# Altium schematic sheet PowerSupply.SchDoc: Smart Bus Ticketing Machine/Power Supply
size A4; Date: 3/10/2025; ApprovedBy: Kiran Gunathilaka; CheckedBy: Kiran Gunathilaka; Author: Kiran Gunathilaka; DrawnBy: Kiran Gunathilaka; DocumentNumber: 07; Revision: v1.2; SheetNumber: 7; SheetTotal: 11
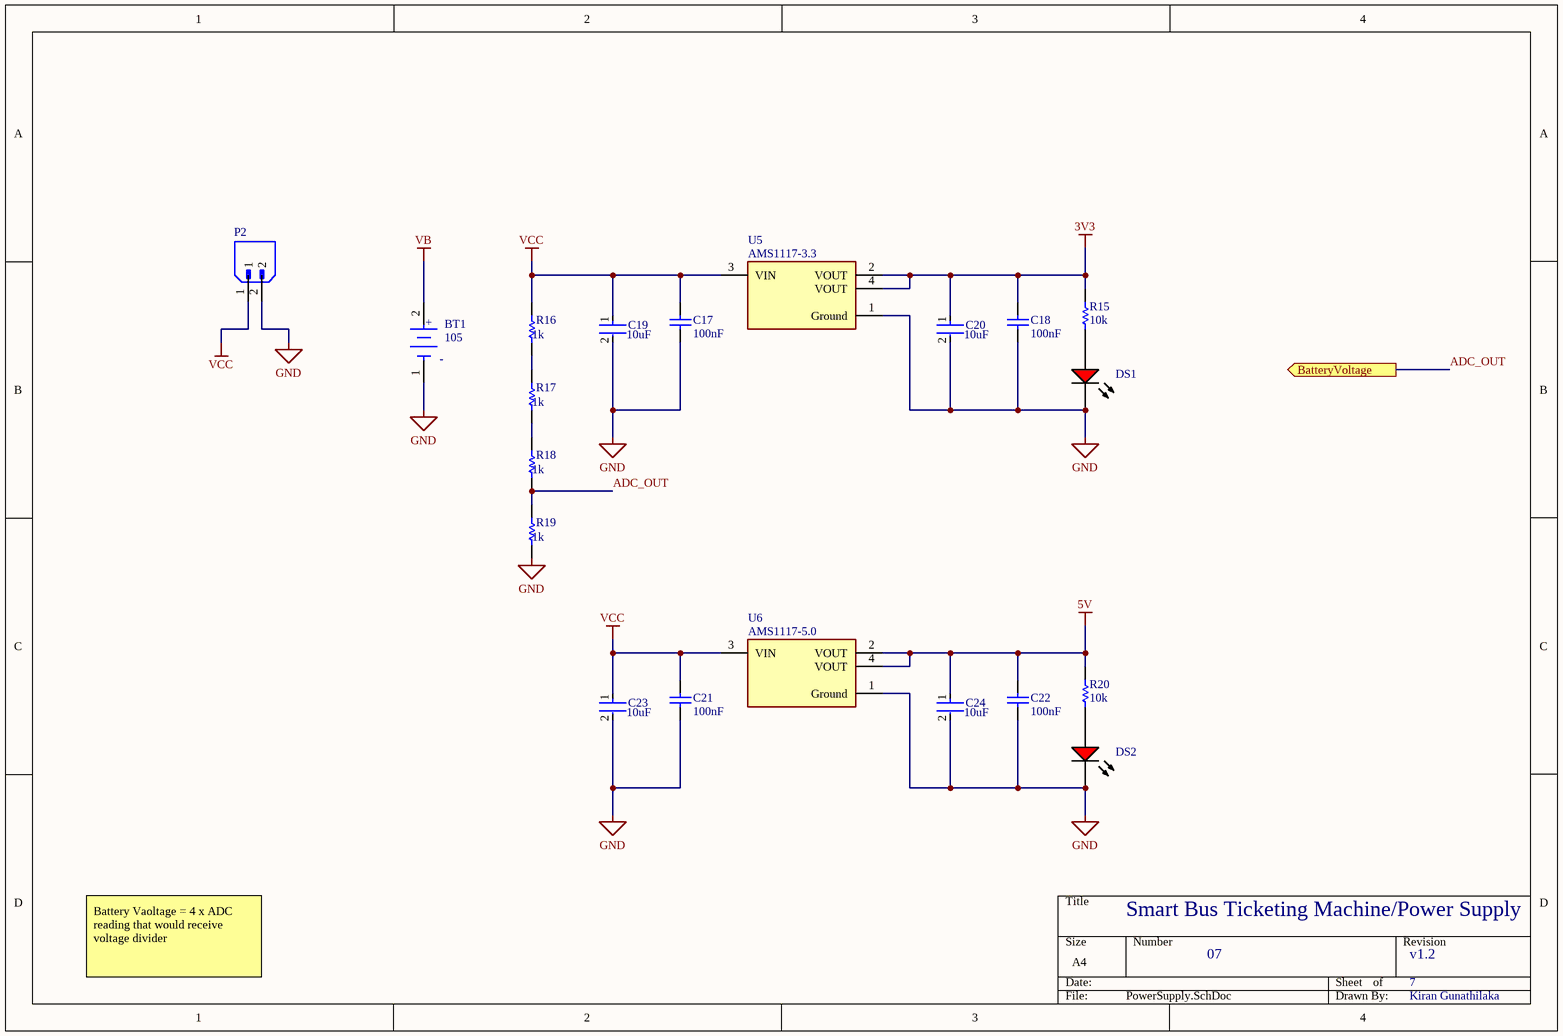
[diagram p0: PowerSupply.SchDoc]

## Parts
BT1  105  [FP-105-MFG]
C17  value 100nF  [CAPC2013X94X50ML20T25]  (hidden comment: 08051C152KAT2A)
C18  value 100nF  [CAPC2013X94X50ML20T25]  (hidden comment: 08051C152KAT2A)
C19  Capacitance: 10uF  [FP-C0805C106K9PACTU-MFG]  (hidden comment: C0805C106K9PACTU)
C20  Capacitance: 10uF  [FP-C0805C106K9PACTU-MFG]  (hidden comment: C0805C106K9PACTU)
C21  value 100nF  [CAPC2013X94X50ML20T25]  (hidden comment: 08051C152KAT2A)
C22  value 100nF  [CAPC2013X94X50ML20T25]  (hidden comment: 08051C152KAT2A)
C23  Capacitance: 10uF  [FP-C0805C106K9PACTU-MFG]  (hidden comment: C0805C106K9PACTU)
C24  Capacitance: 10uF  [FP-C0805C106K9PACTU-MFG]  (hidden comment: C0805C106K9PACTU)
DS1  HSMH-C150  [AVAG-HSMX-C150_V]  (value not drawn)
DS2  HSMH-C150  [AVAG-HSMX-C150_V]  (value not drawn)
P2  Battery Connector  [JST_B2B-XH-A(LF)(SN)]  (value not drawn)
R15  value 10k  [RESC2013X60X35NL10T20]  (hidden comment: RC0805FR-0710KL)
R16  Resistance: 1k  [RESC2013X60X35ML10T20]  (hidden comment: RC0805FR-071KL)
R17  Resistance: 1k  [RESC2013X60X35ML10T20]  (hidden comment: RC0805FR-071KL)
R18  Resistance: 1k  [RESC2013X60X35ML10T20]  (hidden comment: RC0805FR-071KL)
R19  Resistance: 1k  [RESC2013X60X35ML10T20]  (hidden comment: RC0805FR-071KL)
R20  value 10k  [RESC2013X60X35NL10T20]  (hidden comment: RC0805FR-0710KL)
U5  AMS1117-3.3  [FP-AMS1117-IPC_C]
U6  AMS1117-5.0  [FP-AMS1117-IPC_C]

## Ports
BatteryVoltage (out, see Main[1A])

## Nets
3V3: C18.2 C20.1 R15.1 U5.2(VOUT) U5.4(VOUT)
5V: C22.2 C24.1 R20.1 U6.2(VOUT) U6.4(VOUT)
GND: BT1.1(-) C17.1 C18.1 C19.2 C20.2 C21.1 C22.1 C23.2 C24.2 DS1.2(K) DS2.2(K) P2.2 R19.1 U5.1(Ground) U6.1(Ground)
VB: BT1.2(+)
VCC: C17.2 C19.1 C21.2 C23.1 P2.1 R16.2 U5.3(VIN) U6.3(VIN)
ADC_OUT: R18.1 R19.2 ; port BatteryVoltage
NetDS1_1: DS1.1(A) R15.2
NetDS2_1: DS2.1(A) R20.2
NetR16_1: R16.1 R17.2
NetR17_1: R17.1 R18.2

## Notes on the sheet
- Battery Vaoltage = 4 x ADC reading that would receive voltage divider

## Library data of the parts
BT1 = CMP-00214-00028800-1: 105 Battery Holder Coin Cell 1 Cell PC Pin PCB Through Hole Mount PBT 0.944 in. Dia; NexarPartId: 28800; Number of Contacts: 2; Number of Batteries: 1; Approvals: UL; Wire/Cable Gauge: 1AWG; Body Material: Glass, Nylon, PBT; Material: Plastic, Steel; REACH SVHC: No SVHC; Min Operating Temperature: -50°C; Lead Free: Lead Free; Height: 8.75mm; Diameter: 24mm; Termination: PC Pin; Max Operating Temperature: 145°C; Contact Material: Nickel; Number of Cells: 1; Packaging: Bulk; Contact Plating: Nickel; Mount: PCB, Through Hole; RoHS: Compliant
C17 C18 C21 C22 = CMP-2007-04179-1: Manufacturer: AVX Interconnect / Elco; Part Number: 08051C152KAT2A
C19 C20 C23 C24 = CMP-03020-034676-1: CAP CER 10UF 6.3V X5R 0805; Dielectric Material: Ceramic; Dissipation Factor: 5%; Tolerance: 10%; Thickness: 0.055inch; Mount: Surface Mount; Voltage: 6.3V; Case Code (Imperial): 0805; Lead Pitch: 0.75mm; Height: 1.25mm; Construction: Flat; Number of Pins: 2; Contact Material: Tin; Case/Package: 0805; Case Code (Metric): 2012; Termination: SMD/SMT; Width: 1.2mm; Dielectric: X5R; Lead Free: Lead Free; Min Operating Temperature: -55°C; Voltage Rating (DC): 6.3V; Series: C; Packaging: Tape and Reel; Radiation Hardening: No; Length: 2mm; REACH SVHC: No SVHC; RoHS Compliant: Yes; Max Operating Temperature: 85°C; Package Quantity: 1; Voltage Rating: 6.3V; Depth: 1.25mm
DS1 DS2 = CMP-2000-06426-1: LED Uni-Color Red, 65 mW, 25 mA, -40 to 85 degC, 2-Pin SMD, RoHS, Tape and Reel; Manufacturer: Avago; Product Height (mm): 1.1mm; Power Dissipation: 78W; Product Length (mm): 3.2mm; Forward Voltage: 2.6V; Luminous Intensity: 17mcd; DELETED: Compliant; Shape Type: Rectangular; Peak Wavelength: 660nm; Main Category: ChipLED; Dominant Wave Length: 639nm; Rad Hardened: No; Lens Type: ColorlessDiffused; Product Depth (mm): 1.6mm; Reverse Voltage: 5V; Forward Current: 25mA; Chip Material: GaAlAs; Test Current (It): 20mA; Viewing Angle: 170deg; Number of  Elements: 1; Type: Uni-Color; Package Reference: HSMX-C150; Package Description: 2-Pin Surface Mount Device, Body 3.2 x 1.6 mm; Operating Temp Range: -40Cto85C; Mounting: SurfaceMount; Emitting Color: Red; Pin Count: 2; Operating Temperature Classification: Industrial; Datasheet URL: http://media.digikey.com/pdf/Data%20Sheets/Avago%20PDFs/HSMz-Czzz.pdf; Package Type: ChipLed; Mounting Technology: SurfaceMount; High Brightness: No; Lens Dimensions: 2x1.6x0.6mm; Manufacturer URL: http://www.avagotech.com/; Lum Intensity: 17mcd; Datasheet Version: 03/2012; Packaging: TapeandReel
P2 = TX_RX Header
R15 R20 = CMP-1659-00013-4: Chip Resistor, 10 KOhm, +/- 1%, 0.125 W, -55 to 155 degC, 0805 (2012 Metric), RoHS, Tape and Reel; Manufacturer: Yageo; Voltage Rating: 150 V; Mount: Surface Mount; ComponentLink1Description: Manufacturer URL; ComponentLink2URL: http://www.yageo.com/documents/recent/PYu-RC_Group_51_RoHS_L_04.pdf; Pins: 2; Length: 2 mm; Min Operating Temperature: -55 degC; Height: 0.5 mm; Mounting Technology: Surface Mount; RoHSCompliant: true; REACH SVHC: No SVHC; ComponentLink1URL: http://www.yageo.com/; Max Operating Temperature: 155 degC; PackageReference: 0805; DatasheetVersion: Rev. 4, 02/2016; Package Quantity: 5000; Packaging: Tape and Reel; ComponentLink2Description: Datasheet; PackageDescription: 2-Pin Surface Mounted Device, Body 2 x 1.25 mm
R16-R19 = CMP-2100-03671-1: Chip Resistor, 1 KOhm, +/- 1%, 125 mW, -55 to 155 degC, 0805 (2012 Metric), RoHS, Tape and Reel; Manufacturer: Yageo; Temperature Coefficient: 100ppm/degreesC; Voltage Rating (DC): 150V; Max Power Dissipation: 125mW; Number of Pins: 2; Number of Terminations: 2; Datasheet URL: http://www.yageo.com/NewPortal/yageodocoutput?fileName=/pdf/R-Chip/PYu-RC_Group_51_RoHS_L_5.pdf; Length: 0.079inch; Package Description: 2-Pin Surface Mounted Device, Body 2 x 1.25 mm; Depth: 1.25mm; Height: 0.024inch; Military Standard: Not; Case/Package: 0805; Package Reference: 0805; RoHSCompliant: true; Lead Free: LeadFree; Packaging: TapeandReel; Package Quantity: 1; Datasheet Version: Rev. 5, 10/2016; Tolerance: 1%; Min Operating Temperature: -55degC; Voltage Rating: 150V; Composition: ThickFilm; Case Code (Imperial): 0805; Power Rating: 125mW; Width: 0.049inch; Case Code (Metric): 2012; Manufacturer URL: http://www.yageo.com/; Max Operating Temperature: 155degC; REACH SVHC: Unknown; Termination: SMD/SMT
U5 = CMP-209535-000001-1: LDO Voltage Regulators 1A, 3.3V; Manufacturer: Advanced Monolithic Systems; Dropout Voltage: 1.1V; Output Type: Fixed; Nominal Supply Current: 5mA; Max Power Dissipation: 1.2W; Max Supply Voltage: 15V; Number Of Outputs: 1; Standoff Height: 0.64mm; Max Junction Temp: +125°C; Height: 1.8mm; Package: AMS1117; Device Class L2: Power Management ICs; ComponentLink2Description: Datasheet; ComponentLink2URL: http://www.advanced-monolithic.com/pdf/ds1117.pdf; Category: IC; RoHS: TRUE; Automotive: No; Device Class L1: Integrated Circuits (ICs); Output Current: 1A; Device Class L3: Voltage Regulators - Linear; Temperature: -40°C to +125°C; Output Voltage: 3.3V; Manufacturer Part Number: AMS1117-3.3; Temperature Range Low: -40°C; Octopart: https://octopart.com/ams1117-3.3-advanced+monolithic+systems-25899300; Lead Free: Yes; Ipc Land Pattern Name: SOT229P700X180-4; Temperature Range High: +125°C
U6 = CMP-209535-000001-1: LDO Voltage Regulators 1A, 3.3V; Manufacturer Part Number: AMS1117-3.3; Manufacturer: Advanced Monolithic Systems; Dropout Voltage: 1.1V; Output Type: Fixed; Nominal Supply Current: 5mA; Max Power Dissipation: 1.2W; Max Supply Voltage: 15V; Number Of Outputs: 1; Standoff Height: 0.64mm; Max Junction Temp: +125°C; Height: 1.8mm; Package: AMS1117; Device Class L2: Power Management ICs; ComponentLink2Description: Datasheet; ComponentLink2URL: http://www.advanced-monolithic.com/pdf/ds1117.pdf; Category: IC; RoHS: TRUE; Automotive: No; Device Class L1: Integrated Circuits (ICs); Output Current: 1A; Device Class L3: Voltage Regulators - Linear; Temperature: -40°C to +125°C; Output Voltage: 3.3V; Temperature Range Low: -40°C; Octopart: https://octopart.com/ams1117-3.3-advanced+monolithic+systems-25899300; Lead Free: Yes; Ipc Land Pattern Name: SOT229P700X180-4; Temperature Range High: +125°C